# EAGLE schematic Rear_brake_lamp (EAGLE 7.3.0)
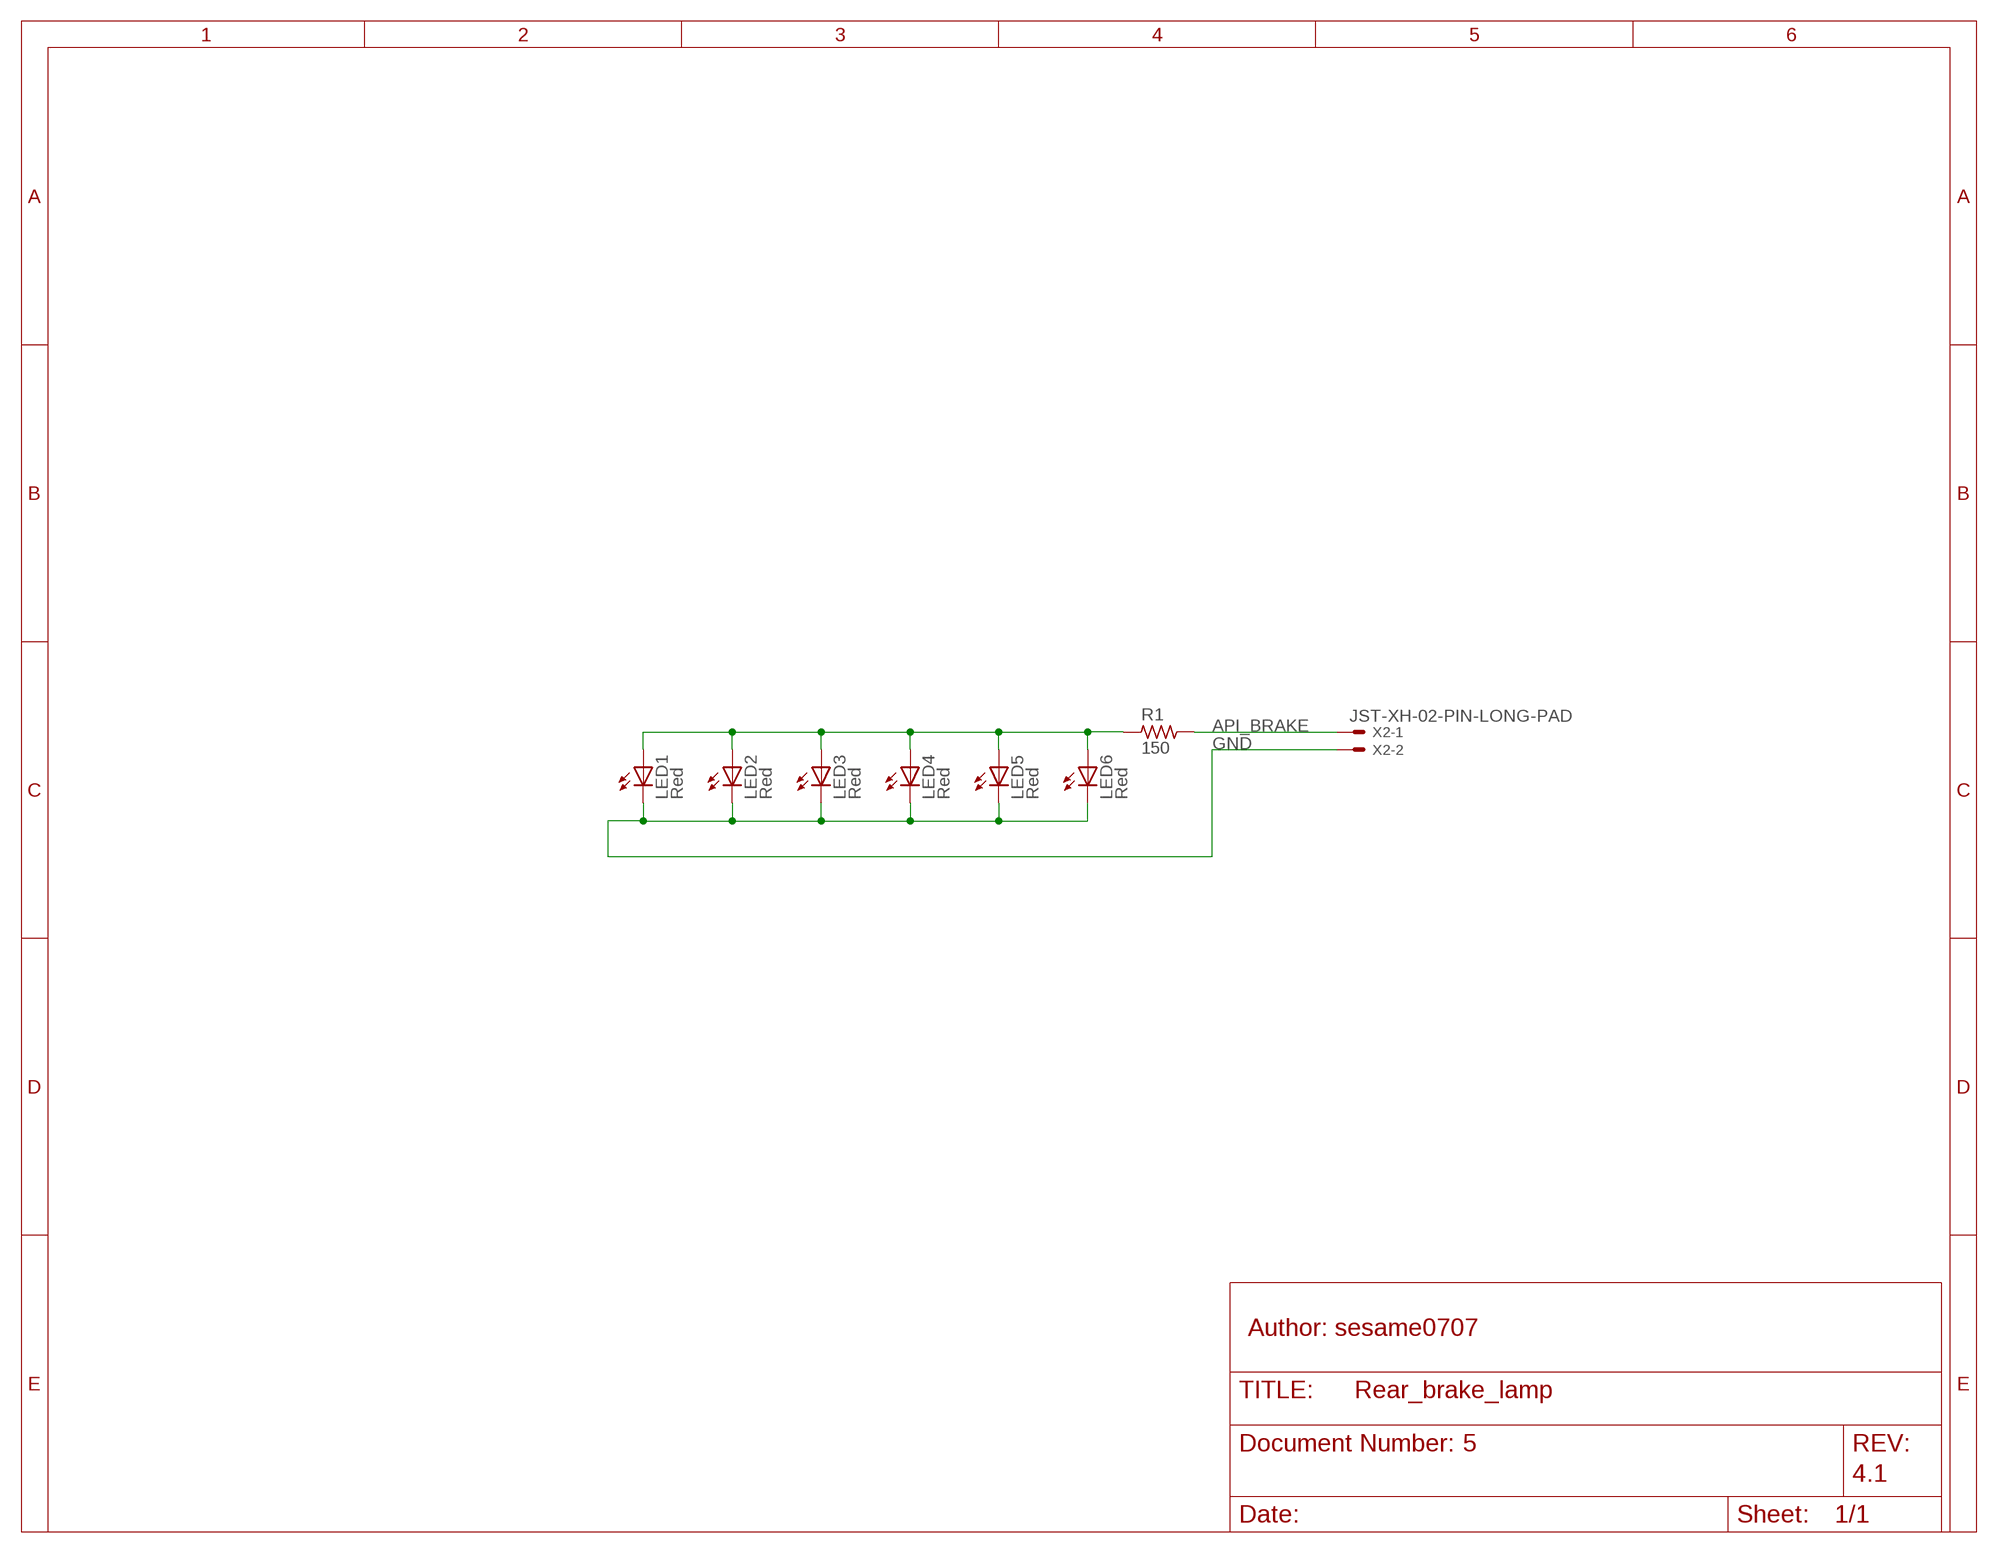
[diagram p0: schematic, sheet 1]

## Parts
LED1  Red  LED5MM  [LED5MM]
LED2  Red  LED5MM  [LED5MM]
LED3  Red  LED5MM  [LED5MM]
LED4  Red  LED5MM  [LED5MM]
LED5  Red  LED5MM  [LED5MM]
LED6  Red  LED5MM  [LED5MM]
R1  150  R_1206  [R1206]
X2  JST-XH-02-PIN-LONG-PAD  [JST-XH-02-PACKAGE-LONG-PAD]

## Nets
API_BRAKE: LED1.A LED2.A LED3.A LED4.A LED5.A LED6.A R1.1
GND: LED1.K(C) LED2.K(C) LED3.K(C) LED4.K(C) LED5.K(C) LED6.K(C) X2.2
N$1: R1.2 X2.1

## Notes on the sheet
- Author: sesame0707
- 5
- 4.1

## Library data of the parts
LED1-LED6 = led:LED: LED OSRAM: - CHIPLED LG R971, LG N971, LY N971, LG Q971, LY Q971, LO R971, LY R971 LH N974, LH R974 LS Q976, LO Q976, LY Q976 LO Q996 - Hyper CHIPLED LW Q18S LB Q993, LB Q99A, LB R99A - SideLED LS A670, LO A670, LY A670, LG A670, LP A670 LB A673, LV A673, LT A673, LW A673 LH A674 LY A675 LS A676, LA A676, LO A676, LY A676, LW A676 LS A679, LY A679, LG A679 - Hyper Micro SIDELED® LS Y876, LA Y876, LO Y876, LY Y876 LT Y87S - SmartLED LW L88C, LW L88S LB L89C, LB L89S, LG L890 LS L89K, LO L89K, LY L89K LS L896, LA L896, LO L896, LY L896 - TOPLED LS T670, LO T670, LY T670, LG T670, LP T670 LSG T670, LSP T670, LSY T670, LOP T670, LYG T670 LG T671, LOG T671, LSG T671 LB T673, LV T673, LT T673, LW T673 LH T674 LS T676, LA T676, LO T676, LY T676, LB T676, LH T676, LSB T676, LW T676 LB T67C, LV T67C, LT T67C, LS T67K, LO T67K, LY T67K, LW E67C LS E67B, LA E67B, LO E67B, LY E67B, LB E67C, LV E67C, LT E67C LW T67C LS T679, LY T679, LG T679 LS T770, LO T770, LY T770, LG T770, LP T770 LB T773, LV T773, LT T773, LW T773 LH T774 LS E675, LA E675, LY E675, LS T675 LS T776, LA T776, LO T776, LY T776, LB T776 LHGB T686 LT T68C, LB T68C - Hyper Mini TOPLED® LB M676 - Mini TOPLED Santana® LG M470 LS M47K, LO M47K, LY M47K Source: http://www.osram.convergy.de LUXEON: - LUMILED® LXK2-PW12-R00, LXK2-PW12-S00, LXK2-PW14-U00, LXK2-PW14-V00 LXK2-PM12-R00, LXK2-PM12-S00, LXK2-PM14-U00 LXK2-PE12-Q00, LXK2-PE12-R00, LXK2-PE12-S00, LXK2-PE14-T00, LXK2-PE14-U00 LXK2-PB12-K00, LXK2-PB12-L00, LXK2-PB12-M00, LXK2-PB14-N00, LXK2-PB14-P00, LXK2-PB14-Q00 LXK2-PR12-L00, LXK2-PR12-M00, LXK2-PR14-Q00, LXK2-PR14-R00 LXK2-PD12-Q00, LXK2-PD12-R00, LXK2-PD12-S00 LXK2-PH12-R00, LXK2-PH12-S00 LXK2-PL12-P00, LXK2-PL12-Q00, LXK2-PL12-R00 Source: www.luxeon.com KINGBRIGHT: KA-3528ASYC Source: www.kingbright.com; COLOR: Red; CURRENT_EMPIRICAL: 1.48 mA; MANUFACTURER: LUCKYLIGHT; MANUFACTURER_PART_NUMBER: LL-503VD2E-1B; SUPPLIER: TME; SUPPLIER_PART_NUMBER: LL-503VD2E-1B; SUPPLIER_URL: https://www.tme.eu/pl/details/ll-503vd2e-1b/diody-led-tht-okragle/luckylight/; VOLTAGE_EMPIRICAL: 1.83 V
R1 = rc-master-smd:R_: RESISTOR; MANUFACTURER: ROYAL OHM; MANUFACTURER_PART_NUMBER: 1206S4J0151T5E; RESISTANCE: 150 Ohm; SUPPLIER: TME; SUPPLIER_PART_NUMBER: 1206S4J0151T5E; SUPPLIER_URL: https://www.tme.eu/pl/details/1206s4j0151t5e/rezystory-smd/royal-ohm/
X2 = Rembrandt Electronics - JST XH Connectors v1-0:JST-XH-02-PIN: JST XH Connector 2 Pin Wire to board connector. Pitch: 2,54 mm, (0.100") Number of pins: 2 Created by Rembrandt Electronics www.rembrandtelectronics.com